# Altium schematic sheet Battery Load Share V1.SchDoc
size A; SheetNumber: 4; SheetTotal: 9
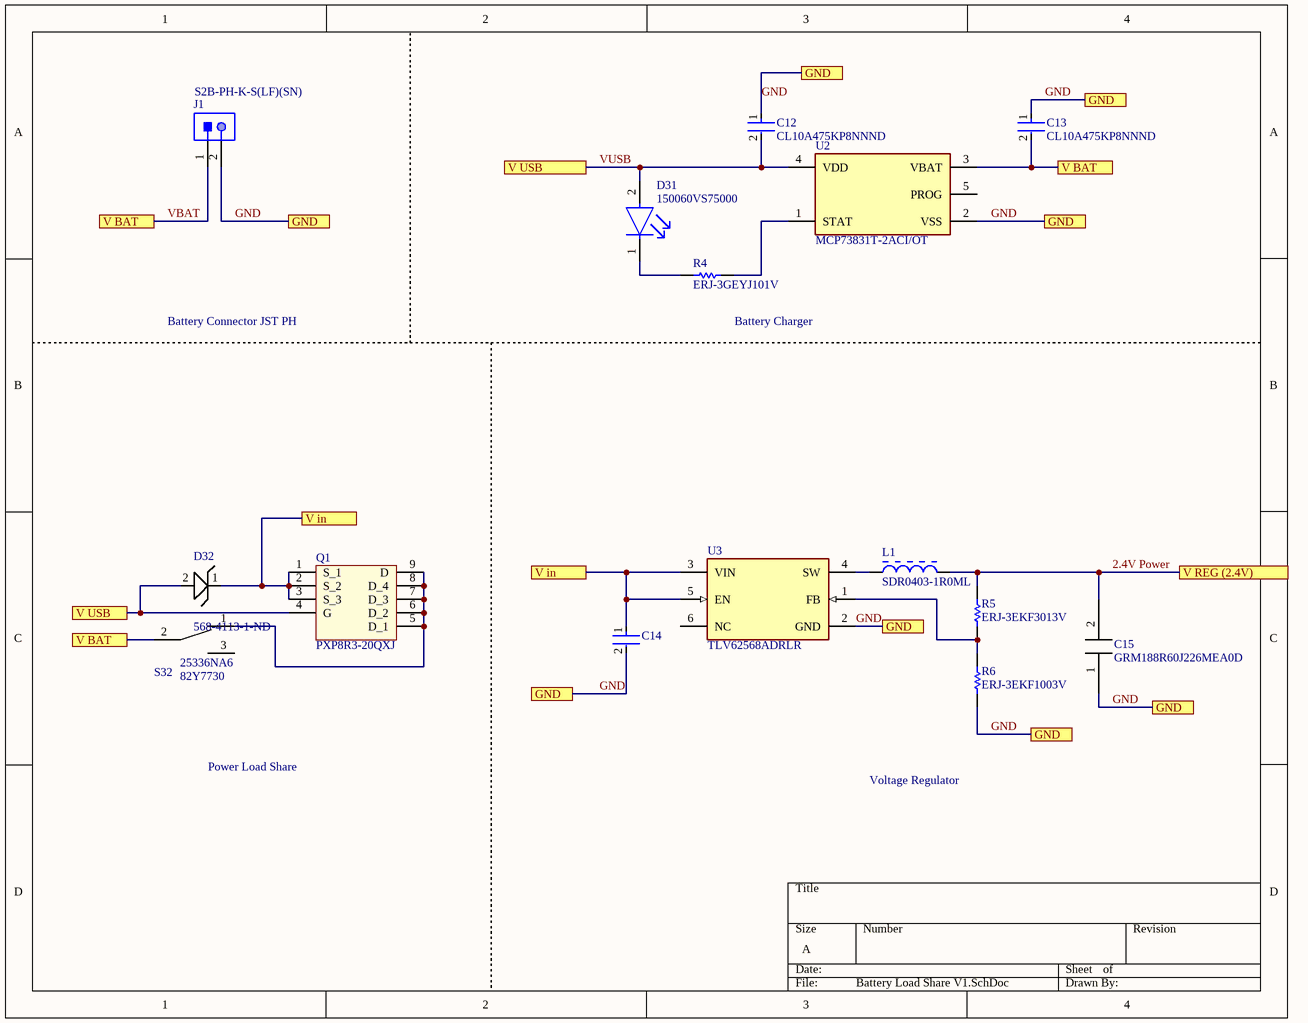
[diagram p0: Battery Load Share V1.SchDoc]

## Parts
C12  CL10A475KP8NNND  [FP-CL10-IPC_C]
C13  CL10A475KP8NNND  [FP-CL10-IPC_C]
C14  C1608X7S1A475K080AC  [FP-C1608-080-MFG]  (value not drawn)
C15  GRM188R60J226MEA0D  [GRM188R60J226MEA0D]
D31  150060VS75000  [FP-150060VS75000-MFG]
D32  Supplier Part Number 1: 568-4113-1-ND  [PMEG2010AEJ]  (hidden comment: PMEG2010AEJ115)
J1  S2B-PH-K-S(LF)(SN)  [JST-S2B-PH-K-S_V]
L1  SDR0403-1R0ML  [BOUR-SDR0403-2_V]
Q1  PXP8R3-20QXJ  [PXP8R3-20QXJ]
R4  ERJ-3GEYJ101V  [RESC1608X55X30LL15T15]
R5  ERJ-3EKF3013V  [RESC1608X55X30ML15T15]
R6  ERJ-3EKF1003V  [RESC1608X55X30ML15T15]
S32  25336NA6  Supplier Part Number 1: 82Y7730  [25336NA6]
U2  MCP73831T-2ACI/OT  [FP-C04-091-OT-IPC_B]
U3  TLV62568ADRLR  [FP-DRL0006A-MFG]

## Ports
GND, V BAT, V in, V REG (2.4V), V USB

## Nets
2.4V Power: C15.2(B) L1.2 R5.2 ; port V REG (2.4V)
GND: C12.1 C13.1 C14.2 C15.1(B) J1.2 R6.1 U2.2(VSS) U3.2(GND) ; port GND
V in: C14.1 D32.1 Q1.1(S_1) Q1.2(S_2) Q1.3(S_3) U3.3(VIN) U3.5(EN) ; port V in
VBAT: C13.2 J1.1 S32.2 U2.3(VBAT) ; port V BAT
VUSB: C12.2 D31.2(A) D32.2 Q1.4(G) U2.4(VDD) ; port V USB
NetD31_1: D31.1(C) R4.1
NetL1_1: L1.1 U3.4(SW)
NetQ1_5: Q1.5(D_1) Q1.6(D_2) Q1.7(D_3) Q1.8(D_4) Q1.9(D) S32.1
NetR4_2: R4.2 U2.1(STAT)
NetR5_1: R5.1 R6.2 U3.1(FB)

Not connected (* = marked no-connect by the designer): S32 3; U2 5(PROG); U3 6(NC)

## Notes on the sheet
- Battery Connector JST PH
- (near R4) Battery Charger
- Power Load Share
- Voltage Regulator

## Library data of the parts
C12 C13 = CMP-13271-003065-1: Cap Ceramic 4.7uF 10V X5R ±10% Pad SMD 0603 +85°C T/R; Height: 0.8mm; Tolerance: 10%; Capacitance: 4.7uF; Voltage Rating: 10V; Voltage Rating (DC): 10V; Packaging: Tape and Reel; Dielectric: X5R; Width: 0.031inch; Max Operating Temperature: 85°C; Radiation Hardening: No; Package Quantity: 10000; Case/Package: 0603; Mount: Surface Mount; Min Operating Temperature: -55°C; Thickness: 0.035inch; Length: 1.6mm; Depth: 0.8mm
C14 = CMP-08246-005491-1: CAP CER 4.7UF 10V X7S 0603; Dielectric Material: Ceramic; Interface: I2C; Frequency: 48MHz; Memory Type: FLASH; Peripherals: Brown-out Detect/Reset; Tolerance: 10%; Oscillator Type: Internal; Number of I/Os: 53; Core Architecture: ARM; Memory Size: 64KB; Voltage Rating: 10V; Lead Free: Lead Free; Case Code (Imperial): 0603; Voltage Rating (DC): 10V; Series: Leopard Gecko; Min Operating Temperature: -40°C; Case/Package: LFBGA; Dielectric: X7S; RoHS Compliant: Yes; Package Quantity: 1000; Capacitance: 4.7uF; Thickness: 800um; Number of Pins: 64; REACH SVHC: No SVHC; Length: 1.6mm; Max Operating Temperature: 125°C; Depth: 0.8mm; Packaging: Tape and Reel; Case Code (Metric): 1608
C15 = GRM188R60J226MEA0D: 0603 22 uF 6.3 V ±20% Tolerance X5R SMT Multilayer Ceramic Capacitor; Manufacturer: Murata; Capacitance: 22uF; Voltage Rating: 6.3V; Supplier 1: Arrow Electronics; Manufacturer Part Number: GRM188R60J226MEA0D; RoHS: Yes; Category: Ceramic Capacitors; Stock 1: 280000; Pricing 1: 4000=0.05660, 8000=0.05370 (USD); Mount: Surface Mount; Case/Package: 0603; Case Code (Metric): 1608; Case Code (Imperial): 0603; Weight: 0.000222oz; Min Operating Temperature: -55°C; Max Operating Temperature: 85°C; Tolerance: 20%; Packaging: Tape and Reel; Package Quantity: 4000; Dielectric: X5R; Termination: SMD/SMT; Voltage Rating (DC): 6.3V; Length: 1.6mm; Width: 0.8mm; Height: 0.8mm; Thickness: 0.039inch; Depth: 0.8mm; REACH SVHC: No SVHC; Lead Free: Lead Free; RoHS Compliant: Yes; ComponentLink1URL: https://datasheet.ciiva.com/29540/partnumbering-e-01-29540442.pdf?src-supplier=Digi-Key; ComponentLink1Description: https://datasheet.ciiva.com/29540/partnumbering-e-01-29540442.pdf?src-supplier=Digi-Key; ComponentLink2URL: https://datasheet.ciiva.com/29540/partnumbering-e-01-29540441.pdf?src-supplier=Digi-Key; ComponentLink2Description: https://datasheet.ciiva.com/29540/partnumbering-e-01-29540441.pdf?src-supplier=Digi-Key; ComponentLink3URL: https://datasheet.ciiva.com/29540/partnumbering-e-01-29540443.pdf?src-supplier=Digi-Key; ComponentLink3Description: https://datasheet.ciiva.com/29540/partnumbering-e-01-29540443.pdf?src-supplier=Digi-Key
D31 = CMP-1426-00006-5: LED GREEN CLEAR 0603 SMD; Viewing Angle: 140°; Reverse Voltage (DC): 5V; Forward Voltage: 2V; Power Rating: 72mW; Lens Size: 0.7mm; Test Current: 20mA; Lens Color: Colorless; Lens Style: Rectangular; Luminous Intensity: 40mcd; Wavelength: 570nm; Length: 1.6mm; Max Operating Temperature: 85°C; Lens Transparency: Clear; Width: 0.8mm; Mount: Surface Mount; Weight: 0.000882oz; Package Quantity: 4000; Packaging: Cut Tape; RoHS Compliant: Yes; Case/Package: 0603; Series: WL-SMCW; Case Code (Metric): 1608; Illumination Color: Green; Color: Green; Case Code (Imperial): 0603; Forward Current: 20mA; Min Operating Temperature: -40°C; Height: 0.8mm; Dominant Wavelength: 570nm; Number of Pins: 2
D32 = PMEG2010AEJ115: NXP         PMEG2010AEJ,115             Schottky Rectifier, Single, 20 V, 1 A, SOD-323F, 2 Pins, 550 mV; Manufacturer: NXP Semiconductors; Max Surge Current: 10A; Forward Current: 1A; Max Reverse Current: 70uA; Forward Voltage: 550mV; Max Repetitive Reverse Voltage (Vrrm): 20V; Supplier 1: Digi-Key; Manufacturer Part Number: PMEG2010AEJ115; RoHS: Yes; Category: Schottky Diodes; Mount: Surface Mount; Number of Pins: 2; Weight: 0.01lb; Min Operating Temperature: -65°C; Max Operating Temperature: 150°C; Package Quantity: 1; Packaging: Tape and Reel; Max Reverse Leakage Current: 70uA; Average Rectified Current: 1A; Peak Non-Repetitive Surge Current: 10A; Max Forward Surge Current (Ifsm): 10A; Termination: SMD/SMT; Element Configuration: Single; Max Reverse Voltage (DC): 20V; Length: 0.25inch; Width: 0.25inch; Height: 0.25inch; Radiation Hardening: No; REACH SVHC: No SVHC; Lead Free: Lead Free; ComponentLink1URL: https://datasheet.ciiva.com/28648/666247-28648370.pdf?src-supplier=Element14; ComponentLink1Description: https://datasheet.ciiva.com/28648/666247-28648370.pdf?src-supplier=Element14; ComponentLink2URL: https://datasheet.ciiva.com/913/pmeg2010aej-913523.pdf?src-supplier=Digi-Key; ComponentLink2Description: https://datasheet.ciiva.com/913/pmeg2010aej-913523.pdf?src-supplier=Digi-Key; ComponentLink3URL: https://datasheet.ciiva.com/4714/pmeg2010aej-117858-4714480.pdf?src-supplier=Mouser; ComponentLink3Description: https://datasheet.ciiva.com/4714/pmeg2010aej-117858-4714480.pdf?src-supplier=Mouser; ComponentLink4URL: https://datasheet.ciiva.com/7965/666247-7965049.pdf?src-supplier=Element14; ComponentLink4Description: https://datasheet.ciiva.com/7965/666247-7965049.pdf?src-supplier=Element14; ComponentLink5URL: https://datasheet.ciiva.com/31423/666247-31423031.pdf?src-supplier=Farnell; ComponentLink5Description: https://datasheet.ciiva.com/31423/666247-31423031.pdf?src-supplier=Farnell; ComponentLink6URL: https://datasheet.ciiva.com/913/pmeg2010aej-913524.pdf?src-supplier=Digi-Key; ComponentLink6Description: https://datasheet.ciiva.com/913/pmeg2010aej-913524.pdf?src-supplier=Digi-Key; ComponentLink7URL: https://datasheet.ciiva.com/913/pmeg2010aej-913525.pdf?src-supplier=Digi-Key; ComponentLink7Description: https://datasheet.ciiva.com/913/pmeg2010aej-913525.pdf?src-supplier=Digi-Key
J1 = CMP-1755-00004-1: Male Header, Pitch 2 mm, 1 x 2 Position, Height 4.8 mm, Tail Length 3.4 mm, -25 to 85 degC, RoHS, Bulk; Case\Package: Radial; Tolerance: 20%; Capacitance: 10 uF; Voltage Rating (DC): 50 V; Packaging: Bulk; ComponentLink1URL: http://www.jst-mfg.com/product/pdf/eng/ePH.pdf; Radiation Hardening: No; Height: 11 mm; Package Quantity: 200; PackageDescription: Male Header, Pitch 2 mm, 1 x 2 Position, Height 4.8 mm, Tail Length 3.4 mm; PackageReference: S2B-PH-K-S; Diameter: 5 mm; Pins: 2; Mount: Through Hole; Max Operating Temperature: 85 degC; Min Operating Temperature: -40 degC; ComponentLink1Description: Datasheet; DatasheetVersion: Dec-12; Length: 11 mm; Lead Pitch: 2 mm; REACH SVHC: No SVHC; Voltage Rating: 50 V; RoHSCompliant: true
L1 = CMP-0904-00016-1: SDR0403 Series Power Inductor, 1 uF +/- 20 %, 0.033 Ohm, -40 to 125 degC, 2-Pin SMD, RoHS, Tape and Reel; Manufacturer: Bourns; RDC (Ohm): 0.033 Max.; SRF (MHz): 150 Min.; I sat (A): 5.5 Typ.; Test Frequency (MHz): 7.96; Tolerance (%): +/- 20; Inductance (uH): 1; Q: 28; I rms (A): 3.8 Max.; PackageDescription: 3-Pin SMD, Dia 4.5 mm, Height 3.5 mm; Packing: Tape and Reel; PackageReference: SDR0403-2; ComponentLink1Description: Manufacturer URL; Temperature Range: -40 to 125 degC; DatasheetVersion: Feb-12; ComponentLink1URL: http://www.bourns.com/; RoHS: TRUE; Mounting Technology: Surface Mount; ComponentLink2Description: Datasheet; PartNumber: SDR0403-1R0ML; ComponentLink2URL: http://www.bourns.com/data/global/pdfs/sdr0403.pdf
Q1 = PXP8R3-20QXJ: PXP8R3-20QX - 20 V, P-channel Trench MOSFET; Manufacturer: Nexperia; Supplier 1: Arrow Electronics; Manufacturer Part Number: PXP8R3-20QXJ; RoHS: No; Category: Uncategorized; Stock 1: 1756; Pricing 1: 1=0.70830, 10=0.62250, 25=0.61630, 50=0.61020, 100=0.46530, 250=0.46060, 500=0.34520, 1000=0.29630 (USD); Supplier Part Number 1: PXP8R3-20QXJ
R4 = CMP-2000-00702-1: Manufacturer: Panasonic; Part Number: ERJ-3GEYJ101V
R5 = CMP-1012-00789-2: Manufacturer: Panasonic; Part Number: ERJ-3EKF3013V
R6 = CMP-2000-00182-1: Manufacturer: Panasonic; Part Number: ERJ-3EKF1003V
S32 = 25336NA6: Switch Slide ON ON SPDT Side Slide 1A 30VDC 20000Cycles PC Pins Thru-Hole; Manufacturer: APEM; Actuator Material: Nylon,Glass,Polyamide; Contact Current Rating: 4A; Voltage Rating (AC): 125V; Max Voltage Rating (AC): 250V; Voltage Rating (DC): 30V; Illumination Type: Non-Illuminated; Electrical Life: 10000Cycles; Switch Travel: 4mm; Switch Function: On-On; Actuator Type: Standard; Actuator Length: 6mm; Supplier 1: Newark; Manufacturer Part Number: 25336NA6; RoHS: Yes; Category: Slide Switches; Stock 1: 209; Pricing 1: 1=4.37000, 10=3.91000, 25=3.70000, 50=3.57000, 100=3.38000, 250=3.13000 (USD); Mount: Through Hole; Contact Plating: Silver; Contact Material: Silver; Mechanical Life: 20000Cycles; Min Operating Temperature: -40°C; Max Operating Temperature: 85°C; Package Quantity: 100; Throw Configuration: SPDT; Max Current Rating: 1A; Packaging: Bulk; Current Rating: 1A; Max Voltage Rating (DC): 30V; Termination: PC Pins; Orientation: Right Angle; Length: 14.1mm; Depth: 13.5mm; REACH SVHC: No SVHC; RoHS Compliant: Yes; ComponentLink1URL: https://datasheet.ciiva.com/22638/1686052-22638216.pdf?src-supplier=Element14; ComponentLink1Description: https://datasheet.ciiva.com/22638/1686052-22638216.pdf?src-supplier=Element14
U2 = CMP-0133-00143-2: IC CONTROLLR LI-ION 4.2V SOT23-5; Max Power Dissipation: 1.54W; Output Current: 500mA; Max Output Voltage: 4.5V; Number of Outputs: 1; Min Output Voltage: 4.168V; Min Supply Voltage: 3.75V; Max Input Voltage: 6V; Voltage Rating: 4.534V; Drain to Source Resistance: 350mR; Max Operating Temperature: 85°C; Length: 0.122inch; Number of Pins: 5; REACH SVHC: No SVHC; Radiation Hardening: No; Min Operating Temperature: -40°C; Weight: 0.00709oz; Contact Plating: Tin; Termination: SMD/SMT; Case/Package: SOT-23; Mount: Surface Mount; Width: 0.071inch; Packaging: Tape and Reel; Number of Cells: 1; Max Charge Current: 500mA; Height: 0.051inch; Number of Channels: 1; Output Voltage: 4.2V; Max Supply Voltage: 6V; Lead Free: Lead Free
U3 = CMP-04918-000153-1: IC REG BUCK ADJUSTABLE 2A SOT563; Min Output Voltage: 600mV; Max Output Voltage: 5.5V; Synchronous Rectifier: Yes; Min Input Voltage: 2.5V; Number of Outputs: 1; Switching Frequency: 1.5MHz; Output Configuration: Positive; Output Type: Adjustable; Output Current: 2A; Min Operating Temperature: -40°C; Case/Package: SOT-563; Packaging: Tape and Reel; Max Operating Temperature: 125°C; Max Input Voltage: 5.5V; Mount: Surface Mount